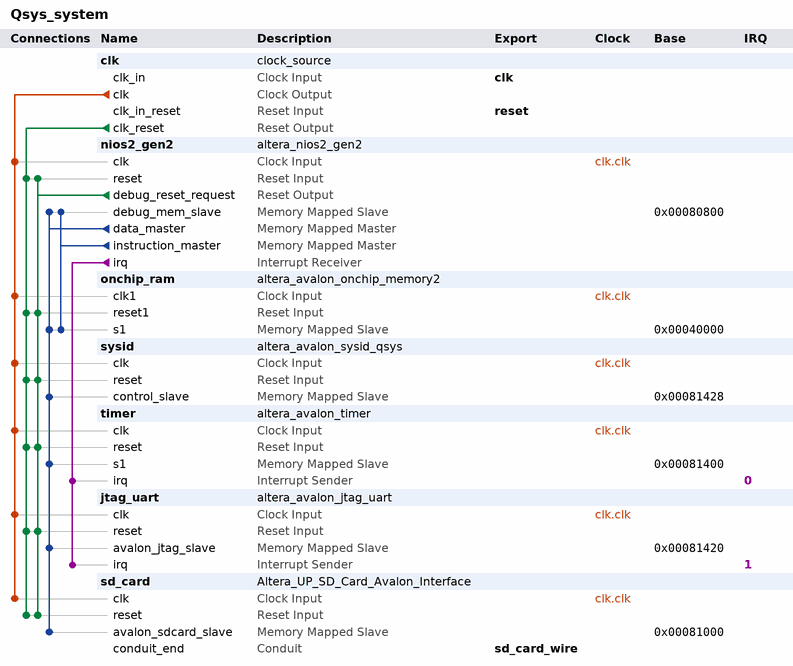
[diagram p0: system contents]
# Platform Designer (Qsys) system Qsys_system, Cyclone IV E EP4CE115F29C7
# Parameters at their usual value, and those the tool derives, are not listed.
package require -exact qsys 15.1
create_system Qsys_system
set_project_property DEVICE_FAMILY {Cyclone IV E}
set_project_property DEVICE EP4CE115F29C7

add_instance clk clock_source 15.1
set_instance_parameter_value clk clockFrequency 50000000

add_instance nios2_gen2 altera_nios2_gen2 15.1
set_instance_parameter_value nios2_gen2 dcache_size 2048
set_instance_parameter_value nios2_gen2 exceptionSlave onchip_ram.s1
set_instance_parameter_value nios2_gen2 icache_size 4096
set_instance_parameter_value nios2_gen2 impl Fast
set_instance_parameter_value nios2_gen2 resetSlave onchip_ram.s1

add_instance onchip_ram altera_avalon_onchip_memory2 15.1
set_instance_parameter_value onchip_ram dataWidth 32
set_instance_parameter_value onchip_ram dualPort false
set_instance_parameter_value onchip_ram initMemContent true
set_instance_parameter_value onchip_ram initializationFileName onchip_mem.hex
set_instance_parameter_value onchip_ram memorySize 262144

add_instance sysid altera_avalon_sysid_qsys 15.1
set_instance_parameter_value sysid id 0

add_instance timer altera_avalon_timer 15.1
set_instance_parameter_value timer period 1
set_instance_parameter_value timer periodUnits MSEC

add_instance jtag_uart altera_avalon_jtag_uart 15.1
set_instance_parameter_value jtag_uart simInteractiveOptions NO_INTERACTIVE_WINDOWS

add_instance sd_card Altera_UP_SD_Card_Avalon_Interface 15.1

# connections
add_connection clk.clk jtag_uart.clk clock
add_connection clk.clk nios2_gen2.clk clock
add_connection clk.clk onchip_ram.clk1 clock
add_connection clk.clk sd_card.clk clock
add_connection clk.clk sysid.clk clock
add_connection clk.clk timer.clk clock
add_connection clk.clk_reset jtag_uart.reset reset
add_connection clk.clk_reset nios2_gen2.reset reset
add_connection clk.clk_reset onchip_ram.reset1 reset
add_connection clk.clk_reset sd_card.reset reset
add_connection clk.clk_reset sysid.reset reset
add_connection clk.clk_reset timer.reset reset
add_connection nios2_gen2.debug_reset_request jtag_uart.reset reset
add_connection nios2_gen2.debug_reset_request nios2_gen2.reset reset
add_connection nios2_gen2.debug_reset_request onchip_ram.reset1 reset
add_connection nios2_gen2.debug_reset_request sd_card.reset reset
add_connection nios2_gen2.debug_reset_request sysid.reset reset
add_connection nios2_gen2.debug_reset_request timer.reset reset
add_connection nios2_gen2.data_master jtag_uart.avalon_jtag_slave avalon
set_connection_parameter_value nios2_gen2.data_master/jtag_uart.avalon_jtag_slave baseAddress 0x00081420
add_connection nios2_gen2.data_master nios2_gen2.debug_mem_slave avalon
set_connection_parameter_value nios2_gen2.data_master/nios2_gen2.debug_mem_slave baseAddress 0x00080800
add_connection nios2_gen2.data_master onchip_ram.s1 avalon
set_connection_parameter_value nios2_gen2.data_master/onchip_ram.s1 baseAddress 0x00040000
add_connection nios2_gen2.data_master sd_card.avalon_sdcard_slave avalon
set_connection_parameter_value nios2_gen2.data_master/sd_card.avalon_sdcard_slave baseAddress 0x00081000
add_connection nios2_gen2.data_master sysid.control_slave avalon
set_connection_parameter_value nios2_gen2.data_master/sysid.control_slave baseAddress 0x00081428
add_connection nios2_gen2.data_master timer.s1 avalon
set_connection_parameter_value nios2_gen2.data_master/timer.s1 baseAddress 0x00081400
add_connection nios2_gen2.instruction_master nios2_gen2.debug_mem_slave avalon
set_connection_parameter_value nios2_gen2.instruction_master/nios2_gen2.debug_mem_slave baseAddress 0x00080800
add_connection nios2_gen2.instruction_master onchip_ram.s1 avalon
set_connection_parameter_value nios2_gen2.instruction_master/onchip_ram.s1 baseAddress 0x00040000
add_connection nios2_gen2.irq jtag_uart.irq interrupt
set_connection_parameter_value nios2_gen2.irq/jtag_uart.irq irqNumber 1
add_connection nios2_gen2.irq timer.irq interrupt
set_connection_parameter_value nios2_gen2.irq/timer.irq irqNumber 0

# exported interfaces
add_interface clk clock sink
set_interface_property clk EXPORT_OF clk.clk_in
add_interface reset reset sink
set_interface_property reset EXPORT_OF clk.clk_in_reset
add_interface sd_card_wire conduit end
set_interface_property sd_card_wire EXPORT_OF sd_card.conduit_end

set_interconnect_requirement {$system} qsys_mm.clockCrossingAdapter HANDSHAKE
set_interconnect_requirement {$system} qsys_mm.enableEccProtection FALSE
set_interconnect_requirement {$system} qsys_mm.insertDefaultSlave FALSE
set_interconnect_requirement {$system} qsys_mm.maxAdditionalLatency 1

save_system Qsys_system.qsys
